# Altium schematic sheet Flyback_schematic.SchDoc
size A3; SheetNumber: 1; SheetTotal: 1
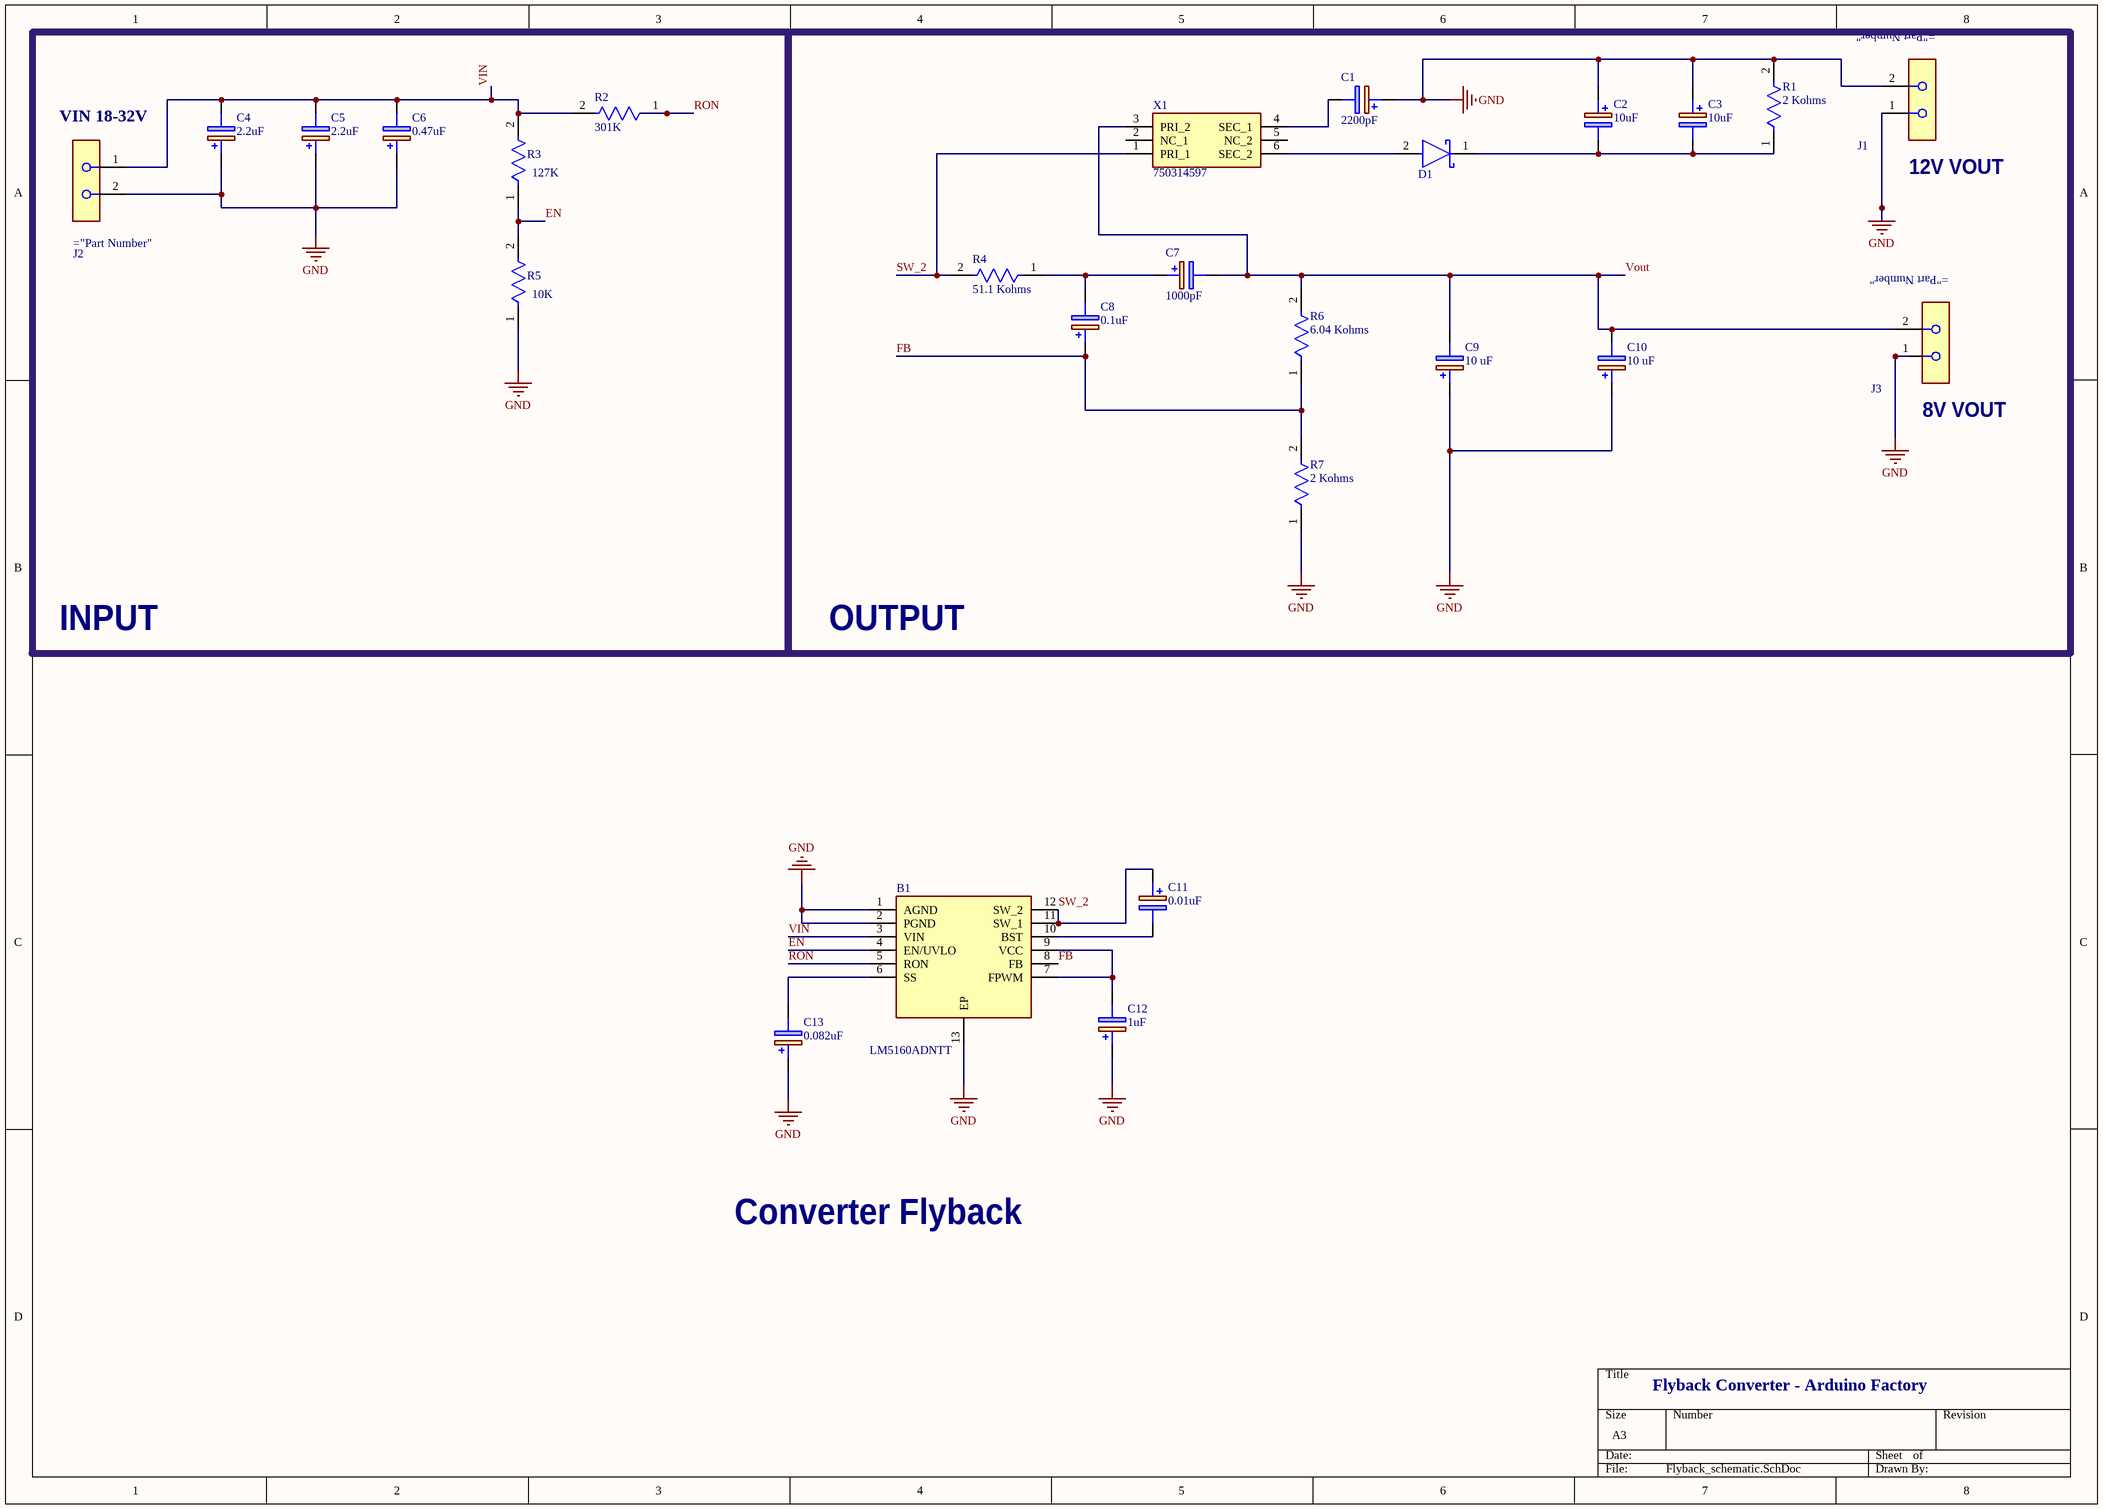
[diagram p0: Flyback_schematic.SchDoc]

## Parts
B1  LM5160ADNTT  [SON50P400X400X100-13N]
C1  2200pF  [CAPPRD500W60D1000H1350]
C2  10uF  [CAPPRD500W60D1000H1350]
C3  10uF  [CAPPRD500W60D1000H1350]
C4  2.2uF  [Vishay_561R_0]
C5  2.2uF  [Vishay_561R_0]
C6  0.47uF  [CAPPRD200W50D550H1250]
C7  1000pF  [CAPPRD500W60D1000H1350]
C8  0.1uF  [CAPPRD500W60D1000H1350]
C9  10 uF  [CAPPRD500W60D1000H1350]
C10  10 uF  [CAPPRD500W60D1000H1350]
C11  0.01uF  [K104K10X7RF53H5]
C12  1uF  [CAPPRD500W60D1000H1350]
C13  0.082uF  [CAPPRD500W60D1000H1350]
D1  Diode_Diodes_DFLS1100-7_eec  [Diodes_DFLS1100-7_0]  (value not drawn)
J1  282837-2  [TE_282837-2_0]  (value not drawn)
J2  282837-2  [TE_282837-2_0]  (value not drawn)
J3  282837-2  [TE_282837-2_0]  (value not drawn)
R1  2 Kohms  [Stackpole_Electronics_Inc._CF14JT1K00_0]
R2  301K  [Stackpole_Electronics_Inc._CF14JT1K00_0]
R3  127K  [Stackpole_Electronics_Inc._CF14JT1K00_0]
R4  51.1 Kohms  [Stackpole_Electronics_Inc._CF14JT1K00_0]
R5  10K  [Stackpole_Electronics_Inc._CF14JT1K00_0]
R6  6.04 Kohms  [Stackpole_Electronics_Inc._CF14JT1K00_0]
R7  2 Kohms  [Stackpole_Electronics_Inc._CF14JT1K00_0]
X1  750314597  [750314597]

## Blocks framed on the sheet
INPUT: C4-C6 J2 R2 R3 R5
OUTPUT: C1-C3 C7-C10 D1 J1 J3 R1 R4 R6 R7 X1

## Nets
GND: B1.1(AGND) B1.2(PGND) B1.13(EP) C1.1(+) C2.1(+) C3.1(+) C4.1(+) C5.1(+) C6.1(+) C9.1(+) C10.1(+) C12.1(+) C13.1(+) J1.1 J1.2 J2.2 J3.1 R1.2 R5.1 R7.1
EN: B1.4(EN/UVLO) R3.1 R5.2
FB: B1.8(FB) C8.1(+) R6.1 R7.2
RON: B1.5(RON) R2.1
SW_2: B1.11(SW_1) B1.12(SW_2) C11.1(+) R4.2 X1.1(PRI_1)
VIN: B1.3(VIN) C4.2(-) C5.2(-) C6.2(-) J2.1 R2.2 R3.2
Vout: C7.2(-) C9.2(-) C10.2(-) J3.2 R6.2 X1.3(PRI_2)
NetB1_6: B1.6(SS) C13.2(-)
NetB1_7: B1.7(FPWM) B1.9(VCC) C12.2(-)
NetB1_10: B1.10(BST) C11.2(-)
NetC1_2: C1.2(-) X1.4(SEC_1)
NetC2_2: C2.2(-) C3.2(-) D1.1(C) R1.1
NetC7_1: C7.1(+) C8.2(-) R4.1
NetD1_2: D1.2(A) X1.6(SEC_2)

Not connected (* = marked no-connect by the designer): X1 2(NC_1) 5(NC_2)

## Notes on the sheet
- (near J2) VIN 18-32V
- (near J1) 12V VOUT
- (near J3) 8V VOUT
- Converter Flyback
- Flyback Converter - Arduino Factory

## Library data of the parts
B1 = LM5160ADNTT: LM5160A Wide Input 65V, 2A Synchronous Buck / Fly-Buck Converter; Manufacturer_Name: Texas Instruments; Geometry.Height: 1mm; Manufacturer_Part_Number: LM5160ADNTT; Mouser Part Number: 595-LM5160ADNTT; Mouser Price/Stock: https://www.mouser.co.uk/ProductDetail/Texas-Instruments/LM5160ADNTT?qs=2iGeymVCXnWysiM%2FMZotQQ%3D%3D; Arrow Part Number: LM5160ADNTT; Arrow Price/Stock: https://www.arrow.com/en/products/lm5160adntt/texas-instruments?region=nac; Datasheet Link: http://www.ti.com/lit/gpn/lm5160a
C1-C13 = ESK227M050AH1EA: 220 F 50 V Aluminum Electrolytic Capacitors Radial, Can 2000 Hrs @ 85C; Manufacturer_Name: KEMET; Geometry.Height: 13.5mm; Manufacturer_Part_Number: ESK227M050AH1EA; Mouser Part Number: 80-ESK227M050AH1EA; Mouser Price/Stock: https://www.mouser.co.uk/ProductDetail/KEMET/ESK227M050AH1EA?qs=w9hhVRgtvfnOjgdKRGLJ5g%3D%3D; Arrow Part Number: ESK227M050AH1EA; Arrow Price/Stock: https://www.arrow.com/en/products/esk227m050ah1ea/kemet-corporation; Datasheet Link: https://connect.kemet.com:7667/gateway/IntelliData-ComponentDocumentation/1.0/download/datasheet/ESK227M050AH9EA.pdf
D1 = Diode_Diodes_DFLS1100-7_eec: DIODE SCHOTTKY 100V POWERDI123; Manufacturer: Diodes; Current - Average Rectified (Io): 1A; Voltage - Forward (Vf) (Max) @ If: 770mV @ 1A; Part Number: DFLS1100-7; helpURL: https://upverter.com/upn/revision/a54e2f16c552ac68/; ComponentLink2Description: Datasheet; Temperature: -55°C to +175°C; Package: POWERDI123; Supplier 2: Mouser; Price: 0.251806392522; Supplier 1: Digi-Key; ComponentLink1URL: https://upverter.com/upn/revision/a54e2f16c552ac68/; Supplier Part Number 2: 621-DFLS1100-7; Supplier Part Number 1: DFLS1100DICT-ND; Voltage: 100V; ComponentLink1Description: Upverter; ComponentLink2URL: http://www.diodes.com/_files/datasheets/ds30497.pdf; RoHS: TRUE; Mouser Part Number: 621-DFLS1100-7; Temperature Range High: +175°C; Digikey Description: DIODE SCHOTTKY 100V POWERDI123; Digikey Part Number: DFLS1100DICT-ND; Lead Free: yes; Temperature Range Low: -55°C; Diode Type: Schottky
R1-R7 = MF0207FTE52-10K
X1 = 750314597: Power Transformers MID-ITIFBK 3.87W SMD Power Transformer; Manufacturer_Name: Wurth Elektronik; Geometry.Height: 8.64mm; Manufacturer_Part_Number: 750314597; Mouser Part Number: 710-750314597; Mouser Price/Stock: https://www.mouser.co.uk/ProductDetail/Wurth-Elektronik/750314597?qs=Bi9WzwbfiOje7VZ5JZKdqA%3D%3D; Arrow Part Number: *; Arrow Price/Stock: *; Datasheet Link: https://katalog.we-online.de/ctm/datasheet/750314597.pdf